# EAGLE schematic 02-PWR (EAGLE 9.6.2)
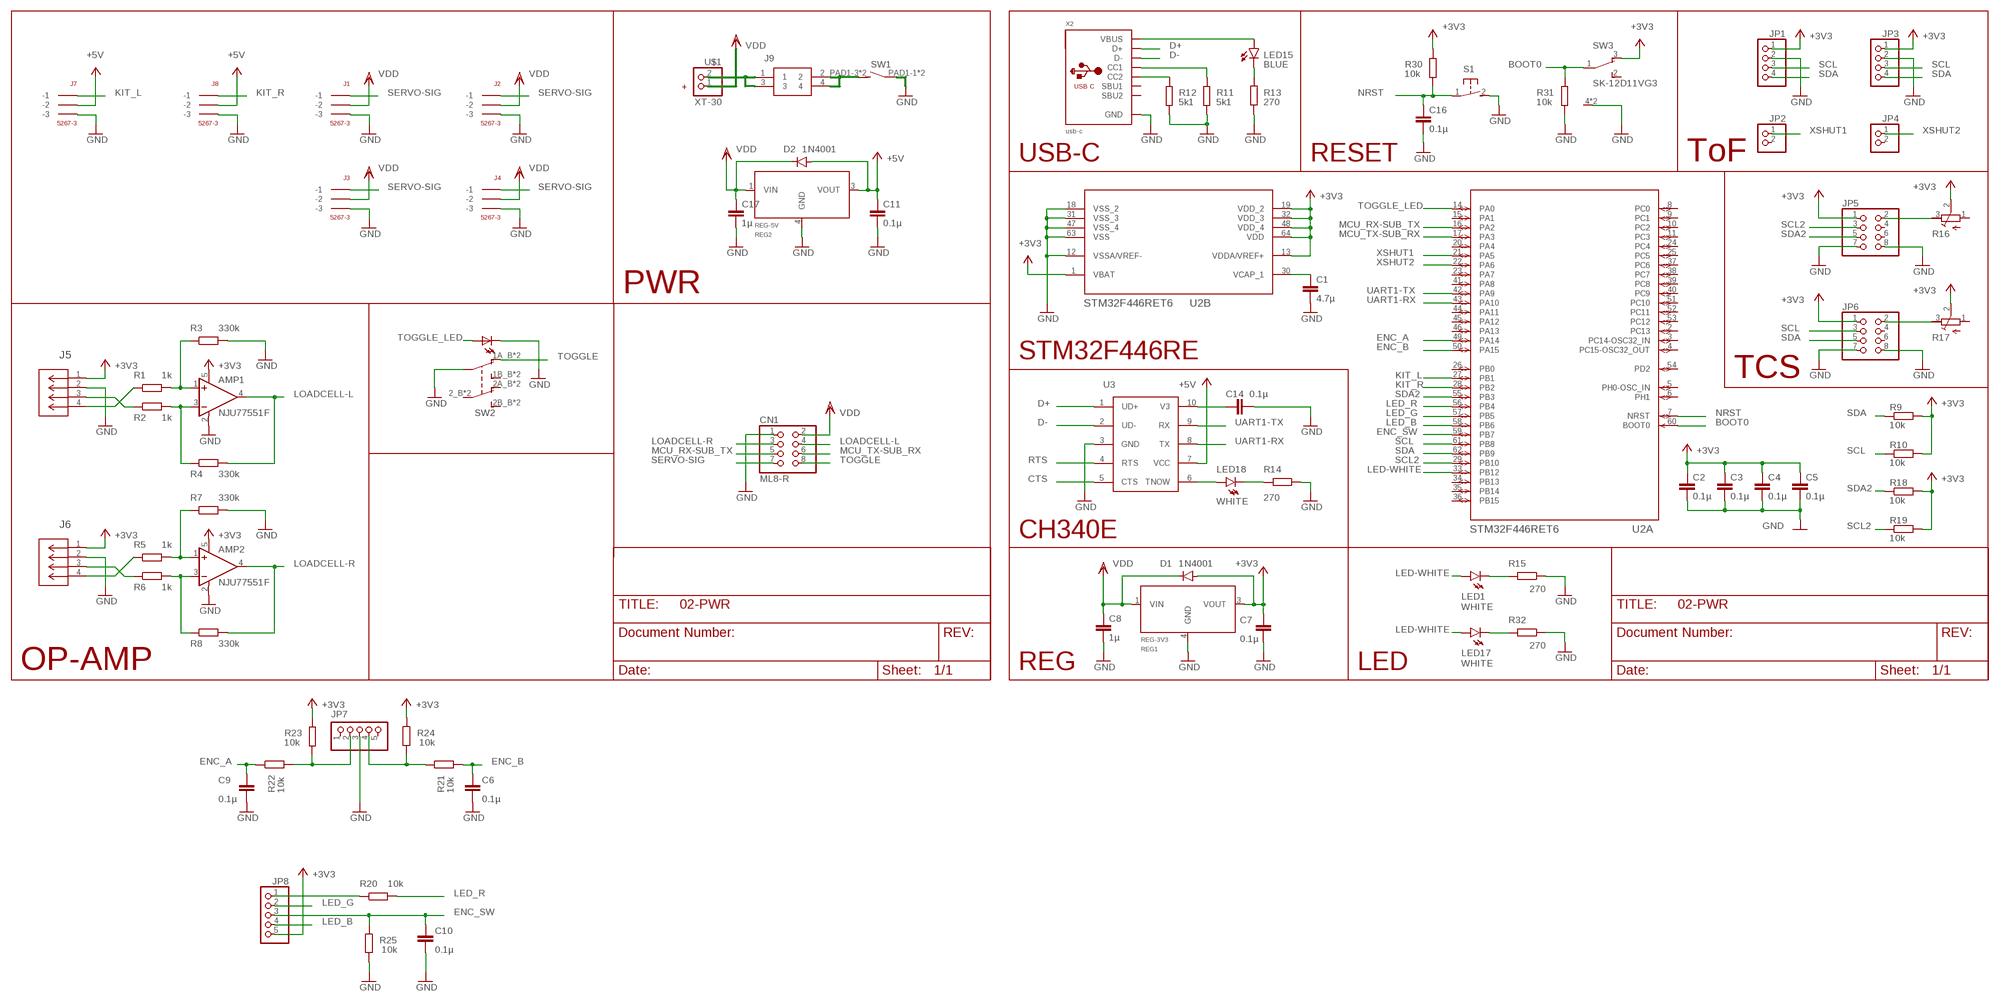
[diagram p0: schematic, sheet 1]

## Parts
AMP1  NJU77551F  [SOT23-5]
AMP2  NJU77551F  [SOT23-5]
C1  4.7µ  C-EUC0603  [C0603]
C2  0.1µ  C-EUC0603  [C0603]
C3  0.1µ  C-EUC0603  [C0603]
C4  0.1µ  C-EUC0603  [C0603]
C5  0.1µ  C-EUC0603  [C0603]
C6  0.1µ  C-EUC0603  [C0603]
C7  0.1µ  C-EUC0603  [C0603]
C8  1µ  C-EUC0603  [C0603]
C9  0.1µ  C-EUC0603  [C0603]
C10  0.1µ  C-EUC0603  [C0603]
C11  0.1µ  C-EUC0603  [C0603]
C14  0.1µ  C-EUC0603  [C0603]
C16  0.1µ  C-EUC0603  [C0603]
C17  1µ  C-EUC0603  [C0603]
CN1  ML8-R  [ML6]
D1  1N4001  GF1  [SMA-DO214AC]
D2  1N4001  GF1  [SMA-DO214AC]
J1  5267-3  [5267-3]
J2  5267-3  [5267-3]
J3  5267-3  [5267-3]
J4  5267-3  [5267-3]
J5  22057045  [CON_22057045_MOL]
J6  22057045  [CON_22057045_MOL]
J7  5267-3  [5267-3]
J8  5267-3  [5267-3]
J9  3557-2  [3557-2]
JP1  PINHD-1X4  [1X04]
JP2  PINHD-1X2  [1X02]
JP3  PINHD-1X4  [1X04]
JP4  PINHD-1X2  [1X02]
JP5  PINHD-2X4  [2X04]
JP6  PINHD-2X4  [2X04]
JP7  PINHD-1X5  [1X05]
JP8  PINHD-1X5  [1X05]
LED1  WHITE  LEDSML0603  [SML0603]
LED15  BLUE  LEDSML0603  [SML0603]
LED17  WHITE  LEDSML0603  [SML0603]
LED18  WHITE  LEDSML0603  [SML0603]
R1  1k  R-EU_R0805  [R0805]
R2  1k  R-EU_R0805  [R0805]
R3  330k  R-EU_R0805  [R0805]
R4  330k  R-EU_R0805  [R0805]
R5  1k  R-EU_R0805  [R0805]
R6  1k  R-EU_R0805  [R0805]
R7  330k  R-EU_R0805  [R0805]
R8  330k  R-EU_R0805  [R0805]
R9  10k  R-EU_R0402  [R0402]
R10  10k  R-EU_R0402  [R0402]
R11  5k1  R-EU_R0402  [R0402]
R12  5k1  R-EU_R0402  [R0402]
R13  270  R-EU_R0402  [R0402]
R14  270  R-EU_R0402  [R0402]
R15  270  R-EU_R0402  [R0402]
R16  R-TRIMM3339P  [RTRIM3339P]
R17  R-TRIMM3339P  [RTRIM3339P]
R18  10k  R-EU_R0402  [R0402]
R19  10k  R-EU_R0402  [R0402]
R20  10k  R-EU_R0402  [R0402]
R21  10k  R-EU_R0402  [R0402]
R22  10k  R-EU_R0402  [R0402]
R23  10k  R-EU_R0402  [R0402]
R24  10k  R-EU_R0402  [R0402]
R25  10k  R-EU_R0402  [R0402]
R30  10k  R-EU_R0402  [R0402]
R31  10k  R-EU_R0402  [R0402]
R32  270  R-EU_R0402  [R0402]
REG1  REG-3V3  MYPARTS_NJM7800S-REGULATOR  [MYPARTS_D-PAK_TO252AA]
REG2  REG-5V  MYPARTS_NJM7800S-REGULATOR  [MYPARTS_D-PAK_TO252AA]
S1  31-XX  [B3F-31XX]
SW1  MYPARTS2_C01B02BKBK-EI  [MYPARTS2_C01B02BKBK-EI]
SW2  TL22  [TL22]
SW3  SK-12D11VG3  [SK-12D11VG3]
U2  STM32F446RET6  [LQFP64-10X10MM]
U3  CH340ESMD  [MSOP10]
U$1  XT-30  [XT-30]
X2  usb-c  USB_C  [USB_C_CUSB31-CFM2AX-01-X]

## Nets
+3V3: AMP1.5(V+) AMP2.5(V+) C2.1 C3.1 C4.1 C5.1 C7.1 D1.A J5.1 J6.1 JP1.1 JP3.1 JP5.1 JP6.1 JP8.5 R9.2 R10.2 R16.2(S) R17.2(S) R18.2 R19.2 R23.1 R24.1 R30.1 REG1.3(VOUT) SW3.3(O) U2.1(B:VBAT) U2.13(B:VDDA/VREF+) U2.19(B:VDD_2) U2.32(B:VDD_3) U2.48(B:VDD_4) U2.64(B:VDD)
+5V: C11.1 D2.A J7.P$2(-2) J8.P$2(-2) REG2.3(VOUT) U3.7(VCC)
BOOT0: R31.1 SW3.1(P) U2.60(A:BOOT0)
CTS: U3.5(CTS)
D+: U3.1(UD+) X2.A6(D+) X2.B6(D+)
D-: U3.2(UD-) X2.A7(D-) X2.B7(D-)
ENC_A: C9.1 R22.1 U2.49(A:PA14)
ENC_B: C6.1 R21.2 U2.50(A:PA15)
ENC_SW: C10.1 JP8.3 R25.1 U2.59(A:PB7)
GND: AMP1.2(V-) AMP2.2(V-) C1.2 C2.2 C3.2 C4.2 C5.2 C6.2 C7.2 C8.2 C9.2 C10.2 C11.2 C14.2 C16.2 C17.2 CN1.1 J1.P$3(-3) J2.P$3(-3) J3.P$3(-3) J4.P$3(-3) J5.2 J6.2 J7.P$3(-3) J8.P$3(-3) JP1.2 JP3.2 JP5.7 JP5.8 JP6.7 JP6.8 JP7.3 R3.2 R7.2 R11.2 R12.2 R13.1 R14.1 R15.1 R25.2 R31.2 R32.1 REG1.4(GND) REG2.4(GND) S1.2(S) SW1.PAD1-1(P) SW1.PAD1-2(P) SW2.1_B SW2.1_T SW2.L-_B(C) SW2.L-_T(C) SW3.4(CASE) SW3.5(CASE) U2.12(B:VSSA/VREF-) U2.18(B:VSS_2) U2.31(B:VSS_3) U2.47(B:VSS_4) U2.63(B:VSS) U3.3(GND) X2.A1B12(GND) X2.B1A12(GND)
KIT_L: J7.P$1(-1) U2.27(A:PB1)
KIT_R: J8.P$1(-1) U2.28(A:PB2)
LED-WHITE: LED1.A LED17.A U2.33(A:PB12)
LED_B: JP8.4 U2.58(A:PB6)
LED_G: JP8.2 U2.57(A:PB5)
LED_R: R20.2 U2.56(A:PB4)
LOADCELL-L: AMP1.4(OUT) CN1.4 R4.2
LOADCELL-R: AMP2.4(OUT) CN1.3 R8.2
MCU_RX-SUB_TX: CN1.5 U2.16(A:PA2)
MCU_TX-SUB_RX: CN1.6 U2.17(A:PA3)
N$1: J5.3 R2.1
N$2: J5.4 R1.1
N$3: AMP1.3(-IN) R2.2 R4.1
N$4: AMP1.1(+IN) R1.2 R3.1
N$5: J6.3 R6.1
N$6: J6.4 R5.1
N$7: AMP2.3(-IN) R6.2 R8.1
N$8: AMP2.1(+IN) R5.2 R7.1
N$9: J9.1 J9.3 U$1.2
N$10: J9.2 J9.4 SW1.PAD1-3(S) SW1.PAD1-4(S)
N$11: C14.1 U3.10(V3)
N$12: LED1.C R15.2
N$13: JP5.2 R16.3(E)
N$14: R11.1 X2.A5(CC1)
N$15: R12.1 X2.B5(CC2)
N$16: LED15.C R13.2
N$17: JP6.2 R17.3(E)
N$18: C1.1 U2.30(B:VCAP_1)
N$19: LED18.A U3.6(TNOW)
N$20: LED18.C R14.2
N$21: JP7.4 R21.1 R24.2
N$22: JP7.2 R22.2 R23.2
N$23: JP8.1 R20.1
N$32: LED17.C R32.2
N$49: LED15.A X2.A4B9(VBUS) X2.B4A9(VBUS)
NRST: C16.1 R30.2 S1.1(P) U2.7(A:NRST)
RTS: U3.4(RTS)
SCL: JP1.3 JP3.3 JP6.3 R10.1 U2.61(A:PB8)
SCL2: JP5.3 R19.1 U2.29(A:PB10)
SDA: JP1.4 JP3.4 JP6.5 R9.1 U2.62(A:PB9)
SDA2: JP5.5 R18.1 U2.55(A:PB3)
SERVO-SIG: CN1.7 J1.P$1(-1) J2.P$1(-1) J3.P$1(-1) J4.P$1(-1)
TOGGLE: CN1.8 SW2.1A_B(1A) SW2.1A_T(1A)
TOGGLE_LED: SW2.L+_B(A) SW2.L+_T(A) U2.14(A:PA0)
UART1-RX: U2.43(A:PA10) U3.8(TX)
UART1-TX: U2.42(A:PA9) U3.9(RX)
VDD: C8.1 C17.1 CN1.2 D1.K(C) D2.K(C) J1.P$2(-2) J2.P$2(-2) J3.P$2(-2) J4.P$2(-2) REG1.1(VIN) REG2.1(VIN) U$1.1
XSHUT1: JP2.1 U2.21(A:PA5)
XSHUT2: JP4.1 U2.22(A:PA6)
Unconnected: JP2.2 JP4.2 JP5.4 JP5.6 JP6.4 JP6.6 JP7.1 JP7.5 R16.1(A) R17.1(A) SW2.1B_B(1B) SW2.1B_T(1B) SW2.2_B SW2.2_T SW2.2A_B(2A) SW2.2A_T(2A) SW2.2B_B(2B) SW2.2B_T(2B) SW3.2(S) U2.2(A:PC13) U2.3(A:PC14-OSC32_IN) U2.4(A:PC15-OSC32_OUT) U2.5(A:PH0-OSC_IN) U2.6(A:PH1) U2.8(A:PC0) U2.9(A:PC1) U2.10(A:PC2) U2.11(A:PC3) U2.15(A:PA1) U2.20(A:PA4) U2.23(A:PA7) U2.24(A:PC4) U2.25(A:PC5) U2.26(A:PB0) U2.34(A:PB13) U2.35(A:PB14) U2.36(A:PB15) U2.37(A:PC6) U2.38(A:PC7) U2.39(A:PC8) U2.40(A:PC9) U2.41(A:PA8) U2.44(A:PA11) U2.45(A:PA12) U2.46(A:PA13) U2.51(A:PC10) U2.52(A:PC11) U2.53(A:PC12) U2.54(A:PD2) X2.A8(SBU1) X2.B8(SBU2)

## Notes on the sheet
- USB-C | RESET | ToF
- PWR
- STM32F446RE
- TCS
- CH340E
- OP-AMP | REG | LED

## Library data of the parts
AMP1 AMP2 = NJU77551F:NJU77551F
C1-C11 C14 C16 C17 = rcl:C-EU: CAPACITOR, European symbol; SPICEPREFIX: C
CN1 = ML8:ML8-R
D1 D2 = diode:GF1: DIODE
J1-J4 J7 J8 = con-molex-spox:5267-3
J5 J6 = con-molex-5268:22057045; COPYRIGHT: Copyright (C) 2022 Ultra Librarian. All rights reserved.; MANUFACTURER_PART_NUMBER: 22057045; MFR_NAME: Molex Connector Corporation
J9 = 3557-15:3557-2: THM 2 in 1 Auto Blade Holder P/N 3557-2 Source: Datasheet <http://www.keyelco.com/product-pdf.cfm?p=296>; DESCRIPTION: THM 2 in 1 Auto Blade Holder P/N 3557-2; HEIGHT: mm; MANUFACTURER_NAME: Keystone Electronics; MANUFACTURER_PART_NUMBER: 3557-2; MOUSER_PART_NUMBER: 534-3557-2; MOUSER_PRICE-STOCK: https://www.mouser.co.uk/ProductDetail/Keystone-Electronics/3557-2?qs=cxy41lVAGV%2FfbyASjpXK1g%3D%3D
JP1 JP3 = pinhead:PINHD-1X4: PIN HEADER
JP2 JP4 = pinhead:PINHD-1X2: PIN HEADER
JP5 JP6 = pinhead:PINHD-2X4: PIN HEADER
JP7 JP8 = pinhead:PINHD-1X5: PIN HEADER
LED1 LED15 LED17 LED18 = led:LED: LED OSRAM: - CHIPLED LG R971, LG N971, LY N971, LG Q971, LY Q971, LO R971, LY R971 LH N974, LH R974 LS Q976, LO Q976, LY Q976 LO Q996 - Hyper CHIPLED LW Q18S LB Q993, LB Q99A, LB R99A - SideLED LS A670, LO A670, LY A670, LG A670, LP A670 LB A673, LV A673, LT A673, LW A673 LH A674 LY A675 LS A676, LA A676, LO A676, LY A676, LW A676 LS A679, LY A679, LG A679 - Hyper Micro SIDELED® LS Y876, LA Y876, LO Y876, LY Y876 LT Y87S - SmartLED LW L88C, LW L88S LB L89C, LB L89S, LG L890 LS L89K, LO L89K, LY L89K LS L896, LA L896, LO L896, LY L896 - TOPLED LS T670, LO T670, LY T670, LG T670, LP T670 LSG T670, LSP T670, LSY T670, LOP T670, LYG T670 LG T671, LOG T671, LSG T671 LB T673, LV T673, LT T673, LW T673 LH T674 LS T676, LA T676, LO T676, LY T676, LB T676, LH T676, LSB T676, LW T676 LB T67C, LV T67C, LT T67C, LS T67K, LO T67K, LY T67K, LW E67C LS E67B, LA E67B, LO E67B, LY E67B, LB E67C, LV E67C, LT E67C LW T67C LS T679, LY T679, LG T679 LS T770, LO T770, LY T770, LG T770, LP T770 LB T773, LV T773, LT T773, LW T773 LH T774 LS E675, LA E675, LY E675, LS T675 LS T776, LA T776, LO T776, LY T776, LB T776 LHGB T686 LT T68C, LB T68C - Hyper Mini TOPLED® LB M676 - Mini TOPLED Santana® LG M470 LS M47K, LO M47K, LY M47K Source: http://www.osram.convergy.de LUXEON: - LUMILED® LXK2-PW12-R00, LXK2-PW12-S00, LXK2-PW14-U00, LXK2-PW14-V00 LXK2-PM12-R00, LXK2-PM12-S00, LXK2-PM14-U00 LXK2-PE12-Q00, LXK2-PE12-R00, LXK2-PE12-S00, LXK2-PE14-T00, LXK2-PE14-U00 LXK2-PB12-K00, LXK2-PB12-L00, LXK2-PB12-M00, LXK2-PB14-N00, LXK2-PB14-P00, LXK2-PB14-Q00 LXK2-PR12-L00, LXK2-PR12-M00, LXK2-PR14-Q00, LXK2-PR14-R00 LXK2-PD12-Q00, LXK2-PD12-R00, LXK2-PD12-S00 LXK2-PH12-R00, LXK2-PH12-S00 LXK2-PL12-P00, LXK2-PL12-Q00, LXK2-PL12-R00 Source: www.luxeon.com KINGBRIGHT: KA-3528ASYC Source: www.kingbright.com
R1-R15 R18-R25 R30-R32 = rcl:R-EU_: RESISTOR, European symbol; SPICEPREFIX: R
R16 R17 = rcl:R-TRIMM: Trimm resistor; SPICEMODEL: X; SPICEPREFIXL: POT
REG1 REG2 = #001-line:MYPARTS_NJM7800S-REGULATOR
S1 = switch-omron:31-XX: OMRON SWITCH; MPN: B3F-3100; OC_FARNELL: 959704; OC_NEWARK: 36M3582
SW1 = #004-high_voltage:MYPARTS2_C01B02BKBK-EI
SW2 = TL22:TL22
SW3 = Slide Switch:SK-12D11VG3
U2 = F446RE:STM32F446RET6; COPYRIGHT: Copyright (C) 2022 Ultra Librarian. All rights reserved.; MANUFACTURER_PART_NUMBER: STM32F446RET6; MFR_NAME: STMicroelectronics
U3 = CH340E:CH340E: WCH.CN/CH340E See DataSheet： wch.cn <http://www.wch.cn/downloads/CH340DS1_PDF.html>
U$1 = XT-30:XT-30
X2 = microbuilder:USB_C: USB Type-C USB 2.0 Connector

## Net classes
0 default: width 0.254 mm